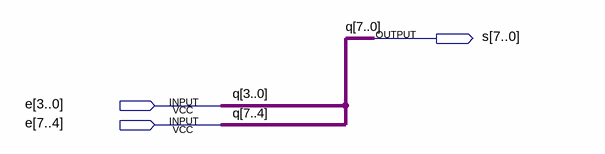
[diagram p0: schematic sheet]
// Quartus schematic TransVetor.bdf as structural Verilog: 0 symbols, 3 pins
module TransVetor (
  input  [7:0] e,
  output [7:0] s
);


  assign s = e;

  // Other names for the same wires on the sheet: q[7:0] = e
endmodule
